# Altium schematic sheet FPGA_Banks.SchDoc: FPGA Banks
size A4; DocumentNumber: 7; SheetNumber: 7; SheetTotal: 18
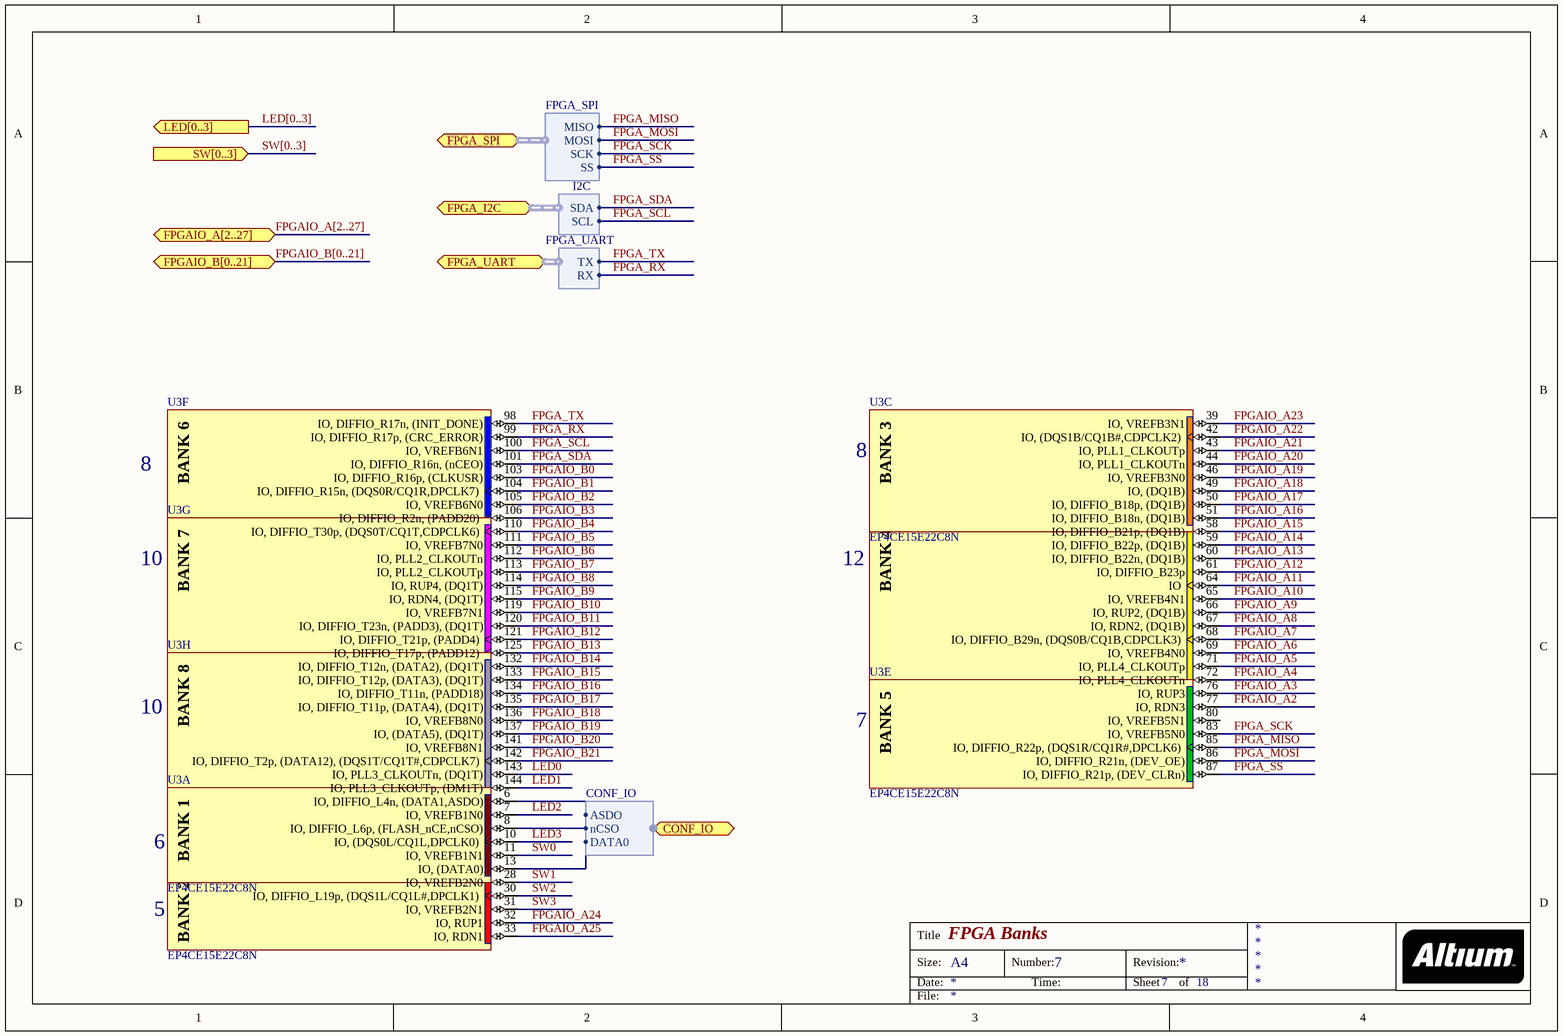
[diagram p0: FPGA_Banks.SchDoc]

## Parts
U3  EP4CE15E22C8N  [EQFP144_A-165_D2-67_N]  (parts A,B,C,D,E,F,G,H of 13)

## Ports
CONF_IO (harness CONF_IO), FPGA_I2C (harness I2C), FPGA_SPI (harness FPGA_SPI), FPGA_UART (harness FPGA_UART), FPGAIO_A[2..27] (bidir), FPGAIO_B[0..21] (bidir, harness TEST_INT), LED[0..3] (out), SW[0..3] (in)

## Harnesses
FPGA_SPI: MISO, MOSI, SCK, SS
I2C: SDA, SCL
FPGA_UART: TX, RX
CONF_IO: ASDO, nCSO, DATA0

## Nets
FPGA_MISO: U3.85(IO,_DIFFIO_R22p,_(DQS1R/CQ1R#,DPCLK6)) ; port FPGA_SPI.MISO
FPGA_MOSI: U3.86(IO,_DIFFIO_R21n,_(DEV_OE)) ; port FPGA_SPI.MOSI
FPGA_RX: U3.99(IO,_DIFFIO_R17p,_(CRC_ERROR)) ; port FPGA_UART.RX
FPGA_SCK: U3.83(IO,_VREFB5N0) ; port FPGA_SPI.SCK
FPGA_SCL: U3.100(IO,_VREFB6N1) ; port FPGA_I2C.SCL
FPGA_SDA: U3.101(IO,_DIFFIO_R16n,_(nCEO)) ; port FPGA_I2C.SDA
FPGA_SS: U3.87(IO,_DIFFIO_R21p,_(DEV_CLRn)) ; port FPGA_SPI.SS
FPGA_TX: U3.98(IO,_DIFFIO_R17n,_(INIT_DONE)) ; port FPGA_UART.TX
FPGAIO_A2: U3.77(IO,_RDN3)
FPGAIO_A3: U3.76(IO,_RUP3)
FPGAIO_A4: U3.72(IO,_PLL4_CLKOUTn)
FPGAIO_A5: U3.71(IO,_PLL4_CLKOUTp)
FPGAIO_A6: U3.69(IO,_VREFB4N0)
FPGAIO_A7: U3.68(IO,_DIFFIO_B29n,_(DQS0B/CQ1B,CDPCLK3))
FPGAIO_A8: U3.67(IO,_RDN2,_(DQ1B))
FPGAIO_A9: U3.66(IO,_RUP2,_(DQ1B))
FPGAIO_A10: U3.65(IO,_VREFB4N1)
FPGAIO_A11: U3.64(IO)
FPGAIO_A12: U3.61(IO,_DIFFIO_B23p)
FPGAIO_A13: U3.60(IO,_DIFFIO_B22n,_(DQ1B))
FPGAIO_A14: U3.59(IO,_DIFFIO_B22p,_(DQ1B))
FPGAIO_A15: U3.58(IO,_DIFFIO_B21p,_(DQ1B))
FPGAIO_A16: U3.51(IO,_DIFFIO_B18n,_(DQ1B))
FPGAIO_A17: U3.50(IO,_DIFFIO_B18p,_(DQ1B))
FPGAIO_A18: U3.49(IO,_(DQ1B))
FPGAIO_A19: U3.46(IO,_VREFB3N0)
FPGAIO_A20: U3.44(IO,_PLL1_CLKOUTn)
FPGAIO_A21: U3.43(IO,_PLL1_CLKOUTp)
FPGAIO_A22: U3.42(IO,_(DQS1B/CQ1B#,CDPCLK2))
FPGAIO_A23: U3.39(IO,_VREFB3N1)
FPGAIO_A24: U3.32(IO,_RUP1)
FPGAIO_A25: U3.33(IO,_RDN1)
FPGAIO_B0: U3.103(IO,_DIFFIO_R16p,_(CLKUSR))
FPGAIO_B1: U3.104(IO,_DIFFIO_R15n,_(DQS0R/CQ1R,DPCLK7))
FPGAIO_B2: U3.105(IO,_VREFB6N0)
FPGAIO_B3: U3.106(IO,_DIFFIO_R2n,_(PADD20))
FPGAIO_B4: U3.110(IO,_DIFFIO_T30p,_(DQS0T/CQ1T,CDPCLK6))
FPGAIO_B5: U3.111(IO,_VREFB7N0)
FPGAIO_B6: U3.112(IO,_PLL2_CLKOUTn)
FPGAIO_B7: U3.113(IO,_PLL2_CLKOUTp)
FPGAIO_B8: U3.114(IO,_RUP4,_(DQ1T))
FPGAIO_B9: U3.115(IO,_RDN4,_(DQ1T))
FPGAIO_B10: U3.119(IO,_VREFB7N1)
FPGAIO_B11: U3.120(IO,_DIFFIO_T23n,_(PADD3),_(DQ1T))
FPGAIO_B12: U3.121(IO,_DIFFIO_T21p,_(PADD4))
FPGAIO_B13: U3.125(IO,_DIFFIO_T17p,_(PADD12))
FPGAIO_B14: U3.132(IO,_DIFFIO_T12n,_(DATA2),_(DQ1T))
FPGAIO_B15: U3.133(IO,_DIFFIO_T12p,_(DATA3),_(DQ1T))
FPGAIO_B16: U3.134(IO,_DIFFIO_T11n,_(PADD18))
FPGAIO_B17: U3.135(IO,_DIFFIO_T11p,_(DATA4),_(DQ1T))
FPGAIO_B18: U3.136(IO,_VREFB8N0)
FPGAIO_B19: U3.137(IO,_(DATA5),_(DQ1T))
FPGAIO_B20: U3.141(IO,_VREFB8N1)
FPGAIO_B21: U3.142(IO,_DIFFIO_T2p,_(DATA12),_(DQS1T/CQ1T#,CDPCLK7))
LED0: U3.143(IO,_PLL3_CLKOUTn,_(DQ1T))
LED1: U3.144(IO,_PLL3_CLKOUTp,_(DM1T))
LED2: U3.7(IO,_VREFB1N0)
LED3: U3.10(IO,_(DQS0L/CQ1L,DPCLK0))
SW0: U3.11(IO,_VREFB1N1)
SW1: U3.28(IO,_VREFB2N0)
SW2: U3.30(IO,_DIFFIO_L19p,_(DQS1L/CQ1L#,DPCLK1))
SW3: U3.31(IO,_VREFB2N1)
NetU3_6: U3.6(IO,_DIFFIO_L4n,_(DATA1,ASDO)) ; port CONF_IO.ASDO
NetU3_8: U3.8(IO,_DIFFIO_L6p,_(FLASH_nCE,nCSO)) ; port CONF_IO.nCSO
NetU3_13: U3.13(IO,_(DATA0)) ; port CONF_IO.DATA0

Not connected (* = marked no-connect by the designer): U3 80(IO,_VREFB5N1)

## Buses and harness runs
bus FPGAIO_A[2..27] = port FPGAIO_A[2..27]
bus FPGAIO_B[0..21]
bus LED[0..3] = port LED[0..3]
bus SW[0..3] = port SW[0..3]

## Notes on the sheet
- 8
- 10
- 12
- 7
- 6
- 5
- Title
- Size:
- Date:
- A4
- Number:
- Time:
- Revision:
- Sheet
- of
- File:
- (in symbol EP4CE15E22C8N, part A) BANK 1
- (in symbol EP4CE15E22C8N, part B) BANK 2
- (in symbol EP4CE15E22C8N, part C) BANK 3
- (in symbol EP4CE15E22C8N, part D) BANK 4
- (in symbol EP4CE15E22C8N, part E) BANK 5
- (in symbol EP4CE15E22C8N, part F) BANK 6
- (in symbol EP4CE15E22C8N, part G) BANK 7
- (in symbol EP4CE15E22C8N, part H) BANK 8

## Library data of the parts
U3 = EP4CE15E22C8N: Cyclone IV Family FPGA, 1.2V Core, 81 I/O Pins, 4 PLLs, 144-Pin QFP, Speed Grade 8, Commercial Grade, Pb-Free; Manufacturer: Altera; DatasheetVersion: ver1.6, Nov-2011; PackageVersion: ver1.0, Jun-2011; PackageReference: EQFP144_A-165_D2-67; PackageDescription: 144-Pin Plastic Enhanced Quad Flat Pack (EQFP) - Wire Bond - A:1.65 - D2:6.7; Code_JEDEC: MS-026-BFB-HD; ComponentLink1Description: Manufacturer URL; ComponentLink1URL: http://www.altera.com/; ComponentLink2Description: Handbook; ComponentLink2URL: http://www.altera.com/literature/hb/cyclone-iv/cyclone4-handbook.pdf; ComponentLink3Description: Pinout; ComponentLink3URL: http://www.altera.com/literature/lit-dp.jsp?category=cyc%204&showspreadsheet=y; ComponentLink4Description: Package Specification; ComponentLink4URL: http://www.altera.com/devicepackaging/04R00221-02.pdf